# Altium schematic sheet BlockSchematic.SchDoc
size A4; Author: Michał Berdzik; CompanyName: AGH
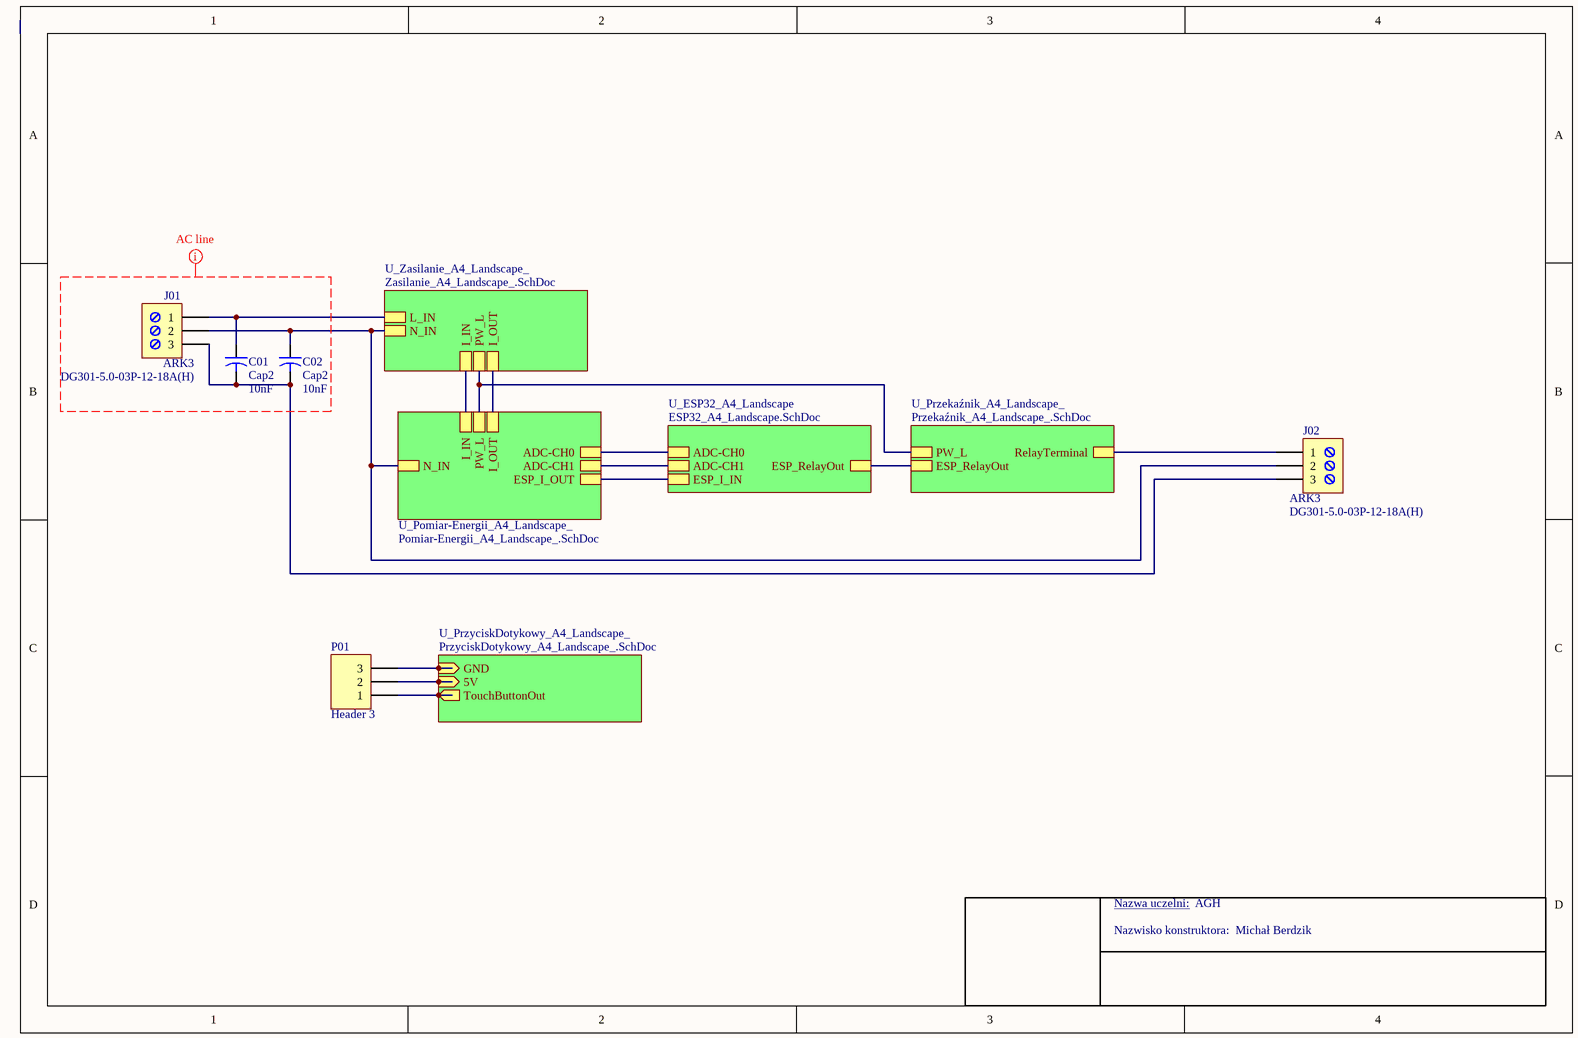
[diagram p0: BlockSchematic.SchDoc]

## Parts
C01  Cap2  value 10nF  [CAPR5-4X5]
C02  Cap2  value 10nF  [CAPR5-4X5]
J01  value DG301-5.0-03P-12-18A(H)  [J_ARK3]  (hidden comment: ARK3)
J02  value DG301-5.0-03P-12-18A(H)  [J_ARK3]  (hidden comment: ARK3)
P01  Header 3  [HDR1X3]

## Sub-sheets
U_ESP32_A4_Landscape = ESP32_A4_Landscape.SchDoc: ESP_RelayOut, ADC-CH0, ADC-CH1, ESP_I_IN
U_Pomiar-Energii_A4_Landscape_ = Pomiar-Energii_A4_Landscape_.SchDoc: ADC-CH0, ADC-CH1, PW_L, N_IN, I_IN, I_OUT, ESP_I_OUT
U_Przekaźnik_A4_Landscape_ = Przekaźnik_A4_Landscape_.SchDoc: ESP_RelayOut, PW_L, RelayTerminal
U_PrzyciskDotykowy_A4_Landscape_ = PrzyciskDotykowy_A4_Landscape_.SchDoc: GND (in), 5V (in), TouchButtonOut (out)
U_Zasilanie_A4_Landscape_ = Zasilanie_A4_Landscape_.SchDoc: I_OUT, I_IN, L_IN, N_IN, PW_L

## Nets
NetC01_1: C01.1 J01.1 ; sheet U_Zasilanie_A4_Landscape_/L_IN
NetC01_2: C01.2 C02.2 J01.3 J02.3
NetC02_1: C02.1 J01.2 J02.2 ; sheet U_Zasilanie_A4_Landscape_/N_IN, sheet U_Pomiar-Energii_A4_Landscape_/N_IN
NetJ02_1: J02.1 ; sheet U_Przekaźnik_A4_Landscape_/RelayTerminal
NetP01_1: P01.1 ; sheet U_PrzyciskDotykowy_A4_Landscape_/TouchButtonOut
NetP01_2: P01.2 ; sheet U_PrzyciskDotykowy_A4_Landscape_/5V
NetP01_3: P01.3 ; sheet U_PrzyciskDotykowy_A4_Landscape_/GND
(unnamed): sheet U_Zasilanie_A4_Landscape_/I_OUT, sheet U_Pomiar-Energii_A4_Landscape_/I_OUT
(unnamed): sheet U_Zasilanie_A4_Landscape_/I_IN, sheet U_Pomiar-Energii_A4_Landscape_/I_IN
(unnamed): sheet U_Zasilanie_A4_Landscape_/PW_L, sheet U_Pomiar-Energii_A4_Landscape_/PW_L, sheet U_Przekaźnik_A4_Landscape_/PW_L
(unnamed): sheet U_Pomiar-Energii_A4_Landscape_/ADC-CH0, sheet U_ESP32_A4_Landscape/ADC-CH0
(unnamed): sheet U_Pomiar-Energii_A4_Landscape_/ADC-CH1, sheet U_ESP32_A4_Landscape/ADC-CH1
(unnamed): sheet U_Pomiar-Energii_A4_Landscape_/ESP_I_OUT, sheet U_ESP32_A4_Landscape/ESP_I_IN
(unnamed): sheet U_ESP32_A4_Landscape/ESP_RelayOut, sheet U_Przekaźnik_A4_Landscape_/ESP_RelayOut

## Layout directives
rule Width Constraint [Pref Width = 40mil    Min Width = 30mil    Max Width = 50mil]; rule Clearance Constraint [Clearance = 40mil]: (no net found under the mark)

## Notes on the sheet
- Nazwa uczelni: <Company Name>
- Nazwisko konstruktora:

## Library data of the parts
C01 C02 = Cap2: Capacitor; Published: 23-Sep-2002; PackageReference: CAPR5-4X5; Publisher: Altium Limited; PackageDescription: Capacitor; 2 Leads
J01 J02 = J_TB-5.0-P-3P: ARK Screw terminal, 3-Pin; Manufacturer: DEGSON ELECTRONICS; SCH_Footprint: ARK3; Part Number: J_TB-5.0-P-3P; Component Type: Standard; HelpURL: https://datasheet.octopart.com/DG301-5.0-03P-12-18A%28H%29-Degson-datasheet-17801202.pdf; Manufacturer Part Number: DG301-5.0-03P-12-18A(H); Supplier 1: TME; Supplier Part Number 1: DG301-5.0-3/6B; Supplier 2: RS Components; Supplier 3: Farnell; Supplier 4: Mouser; Supplier 5: Digi-Key
P01 = Header 3: Header, 3-Pin; LatestRevisionDate: 17-Jul-2002; LatestRevisionNote: Re-released for DXP Platform.; Publisher: Altium Limited